# EAGLE schematic Elcykel-mini (EAGLE 6.2)
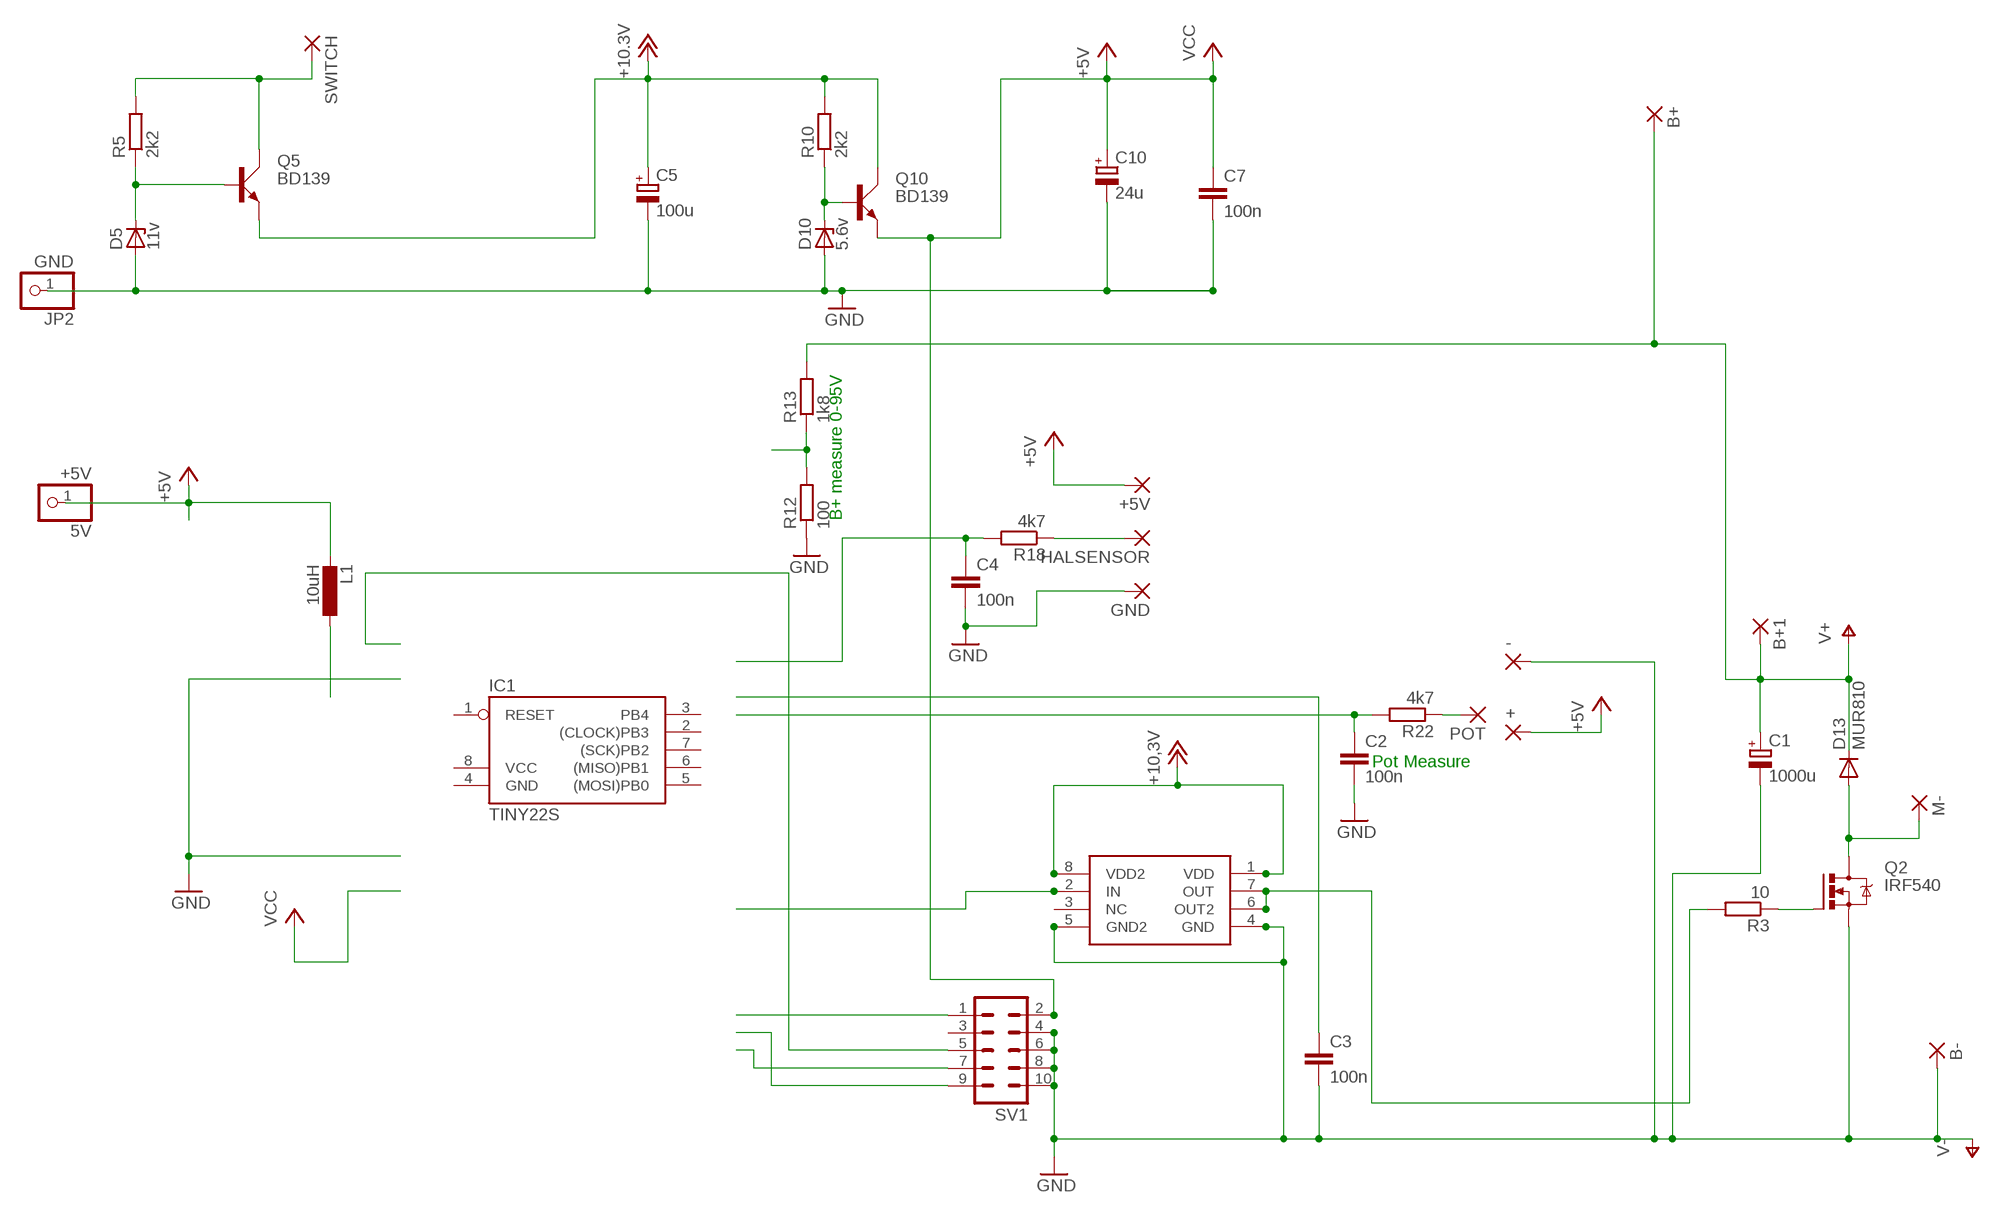
[diagram p0: schematic, sheet 1]

## Parts
5V  +5V  PINHD-1X1  [1X01]
+  2,15/1,0  [2,15/1,0]
+5V  2,15/1,0  [2,15/1,0]
-  2,15/1,0  [2,15/1,0]
B+  WIREPAD4,16O1,6  [4,16O1,6]
B+1  WIREPAD4,16O1,6  [4,16O1,6]
B-  WIREPAD4,16O1,6  [4,16O1,6]
C1  1000u  CPOL-EUE7.5-16  [E7,5-16]
C2  100n  C-EU050-024X044  [C050-024X044]
C3  100n  C-EU050-024X044  [C050-024X044]
C4  100n  C-EU050-024X044  [C050-024X044]
C5  100u  CPOL-EUE2.5-5  [E2,5-5]
C7  100n  C-EU050-024X044  [C050-024X044]
C10  24u  CPOL-EUE2.5-5  [E2,5-5]
D5  11v  BZX55  [DO35Z10]
D10  5.6v  BZX55  [DO35Z10]
D13  MUR810  [TO220ACS]
GND  2,15/1,0  [2,15/1,0]
HALSENSOR  2,15/1,0  [2,15/1,0]
IC1  TINY22S  [SOIC8]
JP2  GND  PINHD-1X1  [1X01]
L1  10uH  L-EU0204/7  [0204/7]
M-  WIREPAD4,16O1,6  [4,16O1,6]
POT  2,15/1,0  [2,15/1,0]
Q2  IRF540  [TO220BV]
Q5  BD139  [TO126AV]
Q10  BD139  [TO126AV]
R3  10  R-EU_0207/2V  [0207/2V]
R5  2k2  R-EU_0207/2V  [0207/2V]
R10  2k2  R-EU_0207/2V  [0207/2V]
R12  100  R-EU_0204/7  [0204/7]
R13  1k8  R-EU_0204/7  [0204/7]
R18  4k7  R-EU_0207/2V  [0207/2V]
R22  4k7  R-EU_0204/7  [0204/7]
SV1  MA05-2  [MA05-2]
SWITCH  1,6/0,9  [1,6/0,9]
U$1  MIC4451  [DIL08]

## Nets
+5V: 5V.1 +5V.1(P) L1.2
+12V: C5.+ Q5.E Q10.C R10.2 U$1.1(VDD) U$1.8(VDD2) ; supply symbol labelled +10,3V, +10.3V
GND: -.1(P) B-.1(P) C1.- C2.2 C3.2 C4.2 C5.- C7.2 C10.- D5.A D10.A GND.1(P) JP2.1 Q2.S R12.1 SV1.4 SV1.6 SV1.8 SV1.10 U$1.4(GND) U$1.5(GND2) ; supply symbol labelled V-
N$6: L1.1
N$9: Q2.G R3.1
N$10: R12.2 R13.1
N$11: D5.C Q5.B R5.1
N$13: C4.1 R18.2
N$17: HALSENSOR.1(P) R18.1
N$20: SV1.1
N$21: SV1.7
N$22: SV1.9
N$24: U$1.2(IN)
N$25: SV1.5
N$26: C3.1
N$27: R3.2 U$1.6(OUT2) U$1.7(OUT)
N$28: D13.A M-.1(P) Q2.D
N$31: D10.C Q10.B R10.1
N$33: C2.1 R22.2
N$34: POT.1(P) R22.1
N$41: Q5.C R5.2 SWITCH.1(P)
V+: B+1.1(P) B+.1(P) C1.+ D13.C R13.2
VCC: +.1(P) C7.1 C10.+ Q10.E SV1.2 ; supply symbol labelled +5V
Unconnected: IC1.1(RESET) IC1.2((CLOCK)PB3) IC1.3(PB4) IC1.5((MOSI)PB0) IC1.6((MISO)PB1) IC1.7((SCK)PB2) SV1.3 U$1.3(NC)

## Notes on the sheet
- B+ measure 0-95V
- Pot Measure

## Power pins joined to a net without a drawn wire
GND: IC1.4(GND)
VCC: IC1.8(VCC)

## Library data of the parts
5V JP2 = pinhead:PINHD-1X1: PIN HEADER
+ +5V - GND HALSENSOR POT = wirepad:2,15/1,0: THROUGH-HOLE PAD
B+ B+1 B- M- = wirepad:WIREPAD: Wire PAD connect wire on PCB
C1 C5 C10 = rcl:CPOL-EU: POLARIZED CAPACITOR, European symbol
C2-C4 C7 = rcl:C-EU: CAPACITOR, European symbol
D5 D10 = diode:BZX55: Z DIODE
D13 = diode:MUR810: DIODE
IC1 = atmel:TINY22: MICROCONTROLLER 1K ROM 128 bytes RAM 128 bytes EEPROM; OC_FARNELL: unknown; OC_NEWARK: unknown
L1 = rcl:L-EU: INDUCTOR, European symbol
Q2 = transistor-power:IRF540: HEXFET Power MOSFET
Q5 Q10 = transistor-power:BD139: NPN TRANSISTOR
R3 R5 R10 R12 R13 R18 R22 = rcl:R-EU_: RESISTOR, European symbol
SV1 = con-lstb:MA05-2: PIN HEADER
SWITCH = wirepad:1,6/0,9: THROUGH-HOLE PAD
U$1 = mic4451:MIC4451